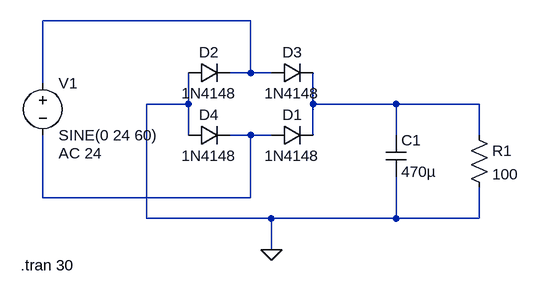
[diagram p0: schematic 24AC_only.asc]
24AC_only.asc, the LTspice schematic file:
Version 4
SHEET 1 2044 680
WIRE 384 32 64 32
WIRE 384 112 384 32
WIRE 384 112 352 112
WIRE 416 112 384 112
WIRE 64 128 64 32
WIRE 288 160 288 112
WIRE 288 160 224 160
WIRE 480 160 480 112
WIRE 608 160 480 160
WIRE 736 160 608 160
WIRE 288 208 288 160
WIRE 384 208 352 208
WIRE 416 208 384 208
WIRE 480 208 480 160
WIRE 608 208 608 160
WIRE 736 208 736 160
WIRE 64 304 64 208
WIRE 384 304 384 208
WIRE 384 304 64 304
WIRE 224 336 224 160
WIRE 416 336 224 336
WIRE 608 336 608 272
WIRE 608 336 416 336
WIRE 736 336 736 288
WIRE 736 336 608 336
WIRE 416 384 416 336
FLAG 416 384 0
SYMBOL voltage 64 112 R0
WINDOW 123 24 124 Left 2
WINDOW 39 0 0 Left 0
SYMATTR Value2 AC 24
SYMATTR InstName V1
SYMATTR Value SINE(0 24 60)
SYMBOL diode 416 224 R270
WINDOW 0 32 32 VTop 2
WINDOW 3 0 32 VBottom 2
SYMATTR InstName D1
SYMATTR Value 1N4148
SYMBOL diode 288 128 R270
WINDOW 0 32 32 VTop 2
WINDOW 3 0 32 VBottom 2
SYMATTR InstName D2
SYMATTR Value 1N4148
SYMBOL diode 416 128 R270
WINDOW 0 32 32 VTop 2
WINDOW 3 0 32 VBottom 2
SYMATTR InstName D3
SYMATTR Value 1N4148
SYMBOL diode 288 224 R270
WINDOW 0 32 32 VTop 2
WINDOW 3 0 32 VBottom 2
SYMATTR InstName D4
SYMATTR Value 1N4148
SYMBOL cap 592 208 R0
SYMATTR InstName C1
SYMATTR Value 470µ
SYMATTR SpiceLine V=50 Irms=3.96 Rser=0.0234673 Lser=0
SYMBOL res 720 192 R0
SYMATTR InstName R1
SYMATTR Value 100
SYMATTR SpiceLine tol=5
TEXT 30 408 Left 2 !.tran 30

The netlist it stands for:
* 24AC_only.asc
V1 N001 N003 SINE(0 24 60) AC 24
D1 N003 N002 1N4148
D2 0 N001 1N4148
D3 N001 N002 1N4148
D4 0 N003 1N4148
C1 N002 0 470µ V=50 Irms=3.96 Rser=0.0234673 Lser=0
R1 N002 0 100 tol=5
.model D D
.lib standard.dio
.tran 30
.backanno
.end